# EasyEDA schematic micrometer_parallelism.json
TITLE: Sheet_1; REV: 1.0; Date: 2024-05-31; Sheet: 1/1; Drawn By: Gabriel Thien; Company: Zydex
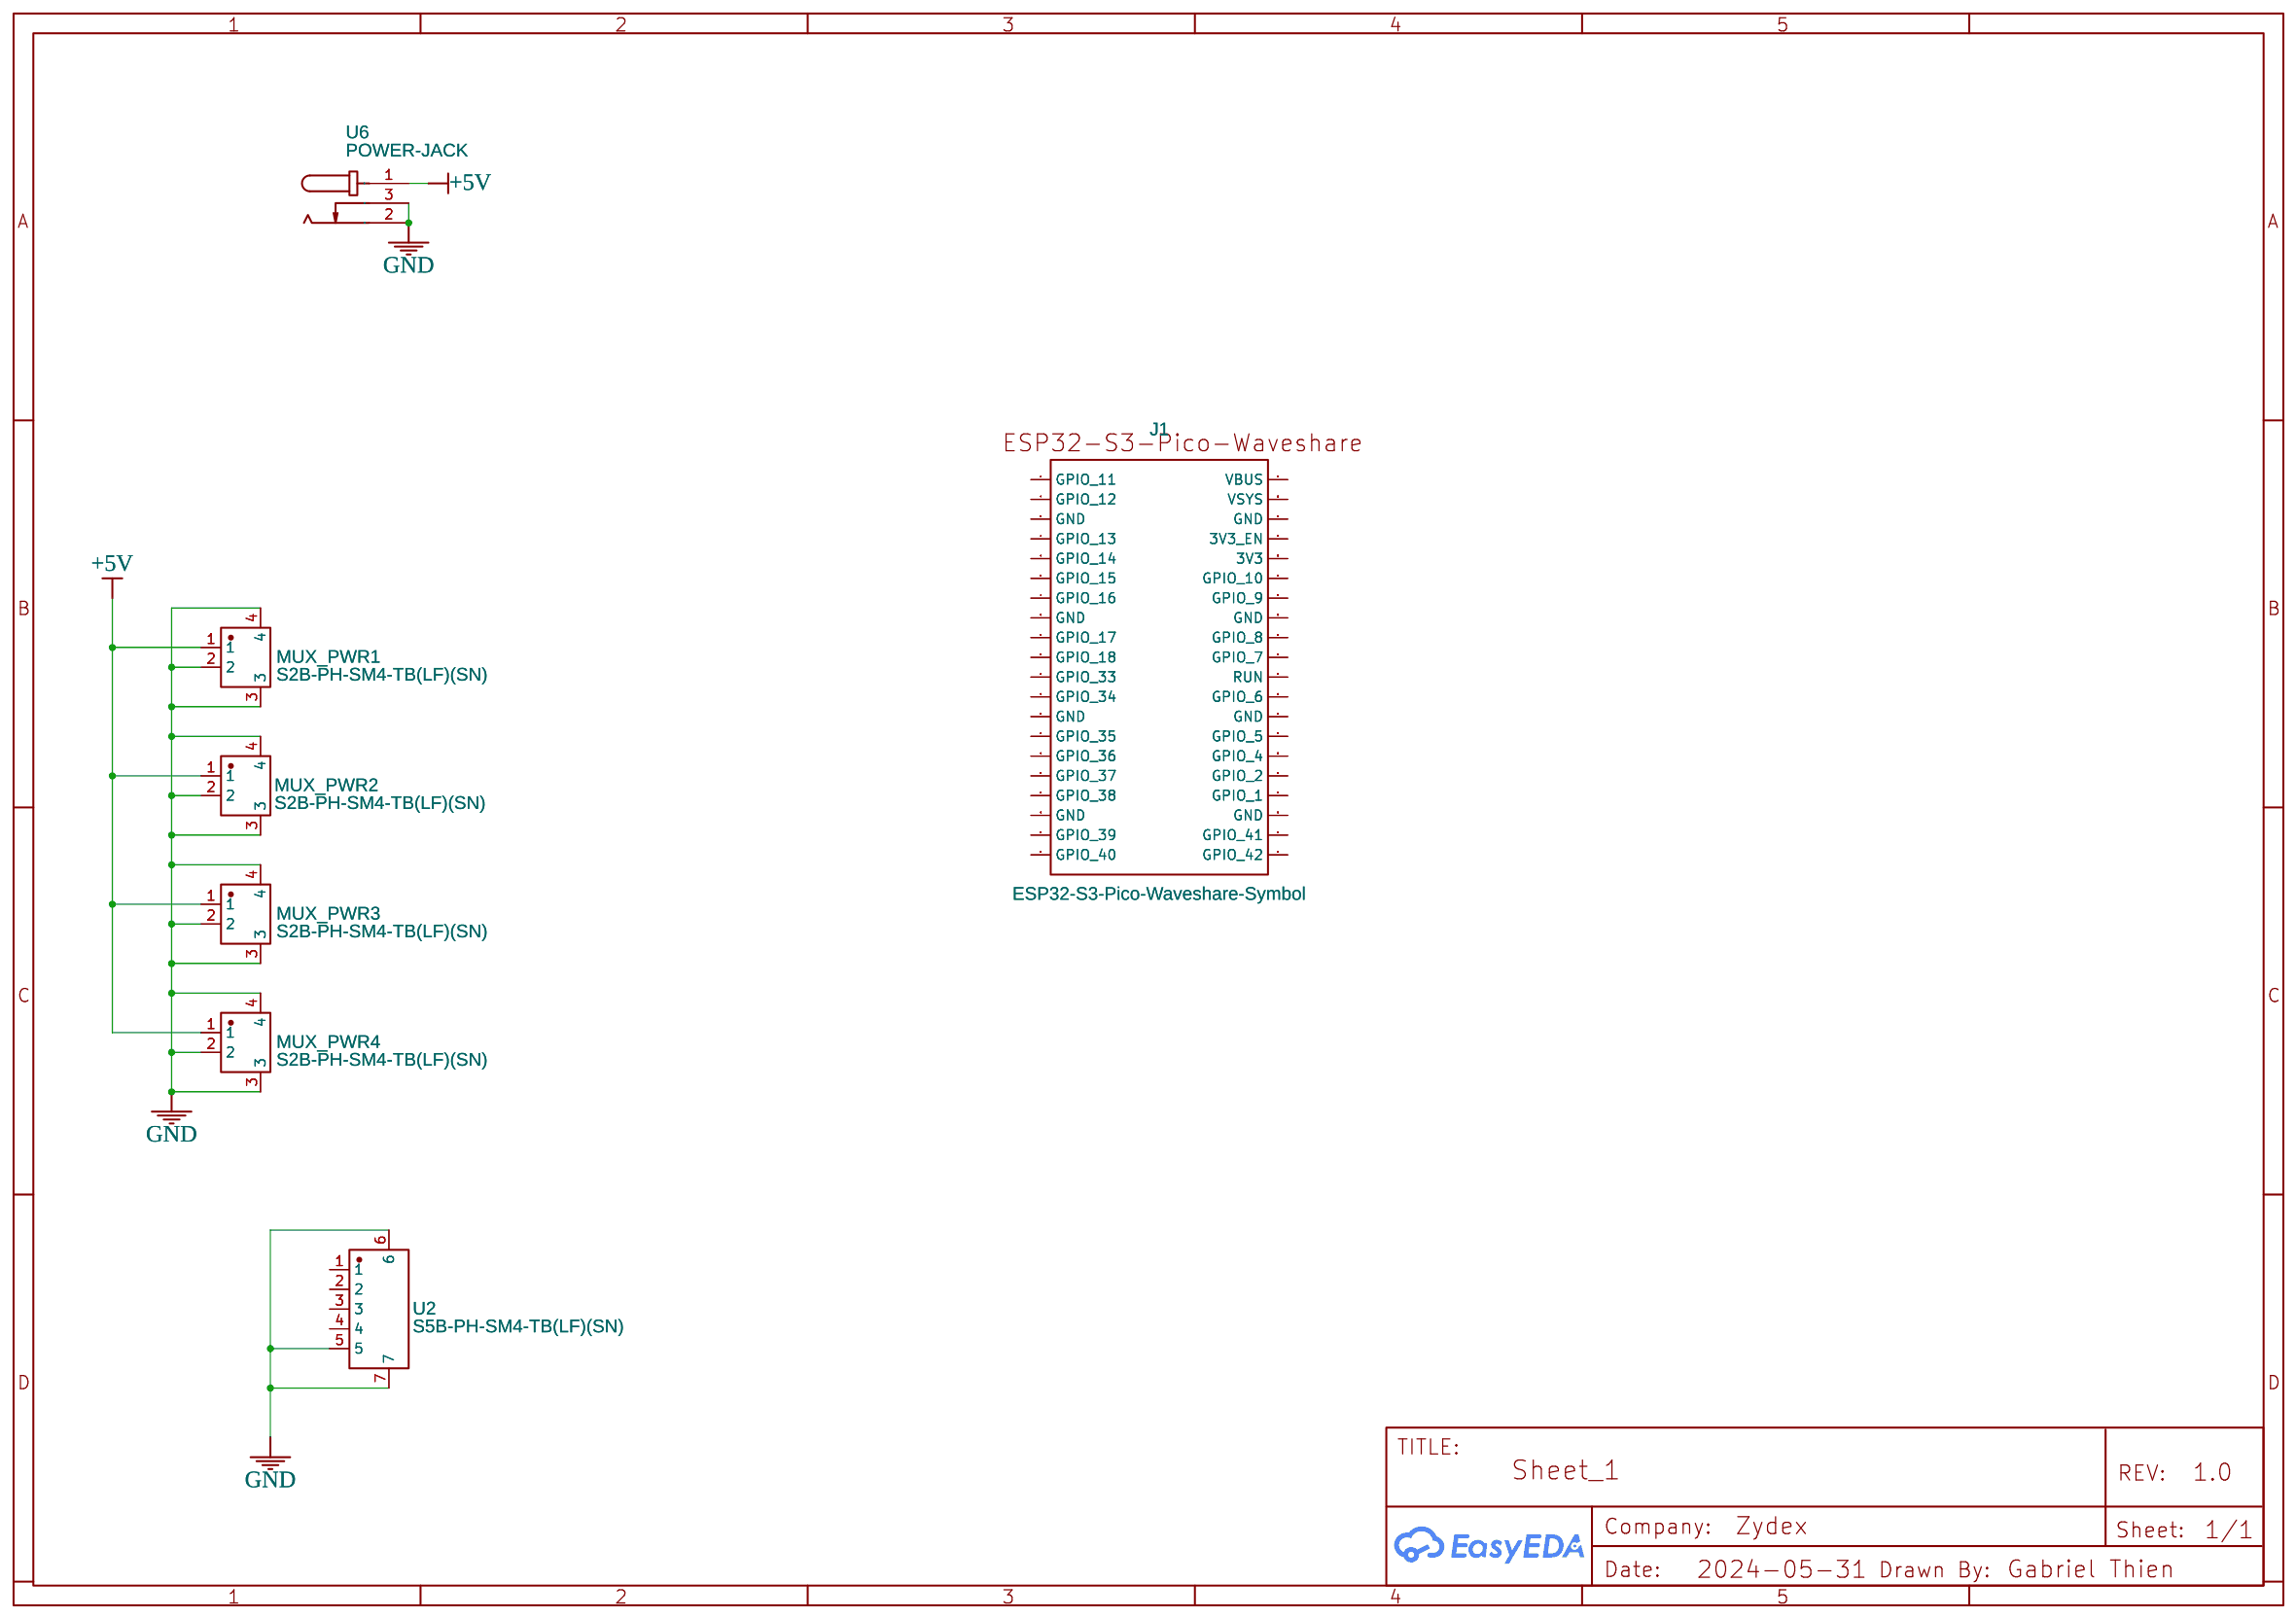
[diagram p0: schematic sheet]

## Parts
J1  ESP32-S3-Pico-Waveshare-Symbol  [ESP32-S3-PICO]
MUX_PWR1  S2B-PH-SM4-TB(LF)(SN)  [CONN-SMD_P2.00_S2B-PH-SM4-TB-LF-SN]
MUX_PWR2  S2B-PH-SM4-TB(LF)(SN)  [CONN-SMD_P2.00_S2B-PH-SM4-TB-LF-SN]
MUX_PWR3  S2B-PH-SM4-TB(LF)(SN)  [CONN-SMD_P2.00_S2B-PH-SM4-TB-LF-SN]
MUX_PWR4  S2B-PH-SM4-TB(LF)(SN)  [CONN-SMD_P2.00_S2B-PH-SM4-TB-LF-SN]
U2  S5B-PH-SM4-TB(LF)(SN)  [CONN-SMD_S5B-PH-SM4-TB-LF-SN]
U6  POWER-JACK  [DC-IN-TH_POWER-JACK]

## Library data of the parts
J1 = ESP32-S3-Pico-Waveshare-Symbol: Supplier Part: ESP32-S3-Pico; Supplier: LCSC; Manufacturer: Waveshare; Contributor: Gabriel Thien
MUX_PWR1-MUX_PWR4 = S2B-PH-SM4-TB(LF)(SN): Contributor: LCSC; Supplier: LCSC; Supplier Part: C295747; Manufacturer: JST; JLCPCB Part Class: Extended Part
U2 = S5B-PH-SM4-TB(LF)(SN): Contributor: LCSC; Supplier: LCSC; Supplier Part: C265104; Manufacturer: JST; JLCPCB Part Class: Extended Part
U6 = POWER-JACK: Contributor: LCSC; Supplier: LCSC; Supplier Part: C9900001795; Manufacturer: 索峰; JLCPCB Part Class: Extended Part; link: https://lcsc.com/eda_search?q=C9900001795&%26type=1&ref=editor

## Nets
+5V: MUX_PWR1.1 MUX_PWR2.1 MUX_PWR3.1 MUX_PWR4.1 U6.1
GND: MUX_PWR1.2 MUX_PWR1.3 MUX_PWR1.4 MUX_PWR2.2 MUX_PWR2.3 MUX_PWR2.4 MUX_PWR3.2 MUX_PWR3.3 MUX_PWR3.4 MUX_PWR4.2 MUX_PWR4.3 MUX_PWR4.4 U2.5 U2.6 U2.7 U6.2 U6.3

Not connected (* = marked no-connect by the designer): J1 1(GPIO_11) 2(GPIO_12) 3(GND) 4(GPIO_13) 5(GPIO_14) 6(GPIO_15) 7(GPIO_16) 8(GND) 9(GPIO_17) 10(GPIO_18) 11(GPIO_33) 12(GPIO_34) 13(GND) 14(GPIO_35) 15(GPIO_36) 16(GPIO_37) 17(GPIO_38) 18(GND) 19(GPIO_39) 20(GPIO_40) 21(GPIO_42) 22(GPIO_41) 23(GND) 24(GPIO_1) 25(GPIO_2) 26(GPIO_4) 27(GPIO_5) 28(GND) 29(GPIO_6) 30(RUN) 31(GPIO_7) 32(GPIO_8) 33(GND) 34(GPIO_9) 35(GPIO_10) 36(3V3) 37(3V3_EN) 38(GND) 39(VSYS) 40(VBUS); U2 1 2 3 4
